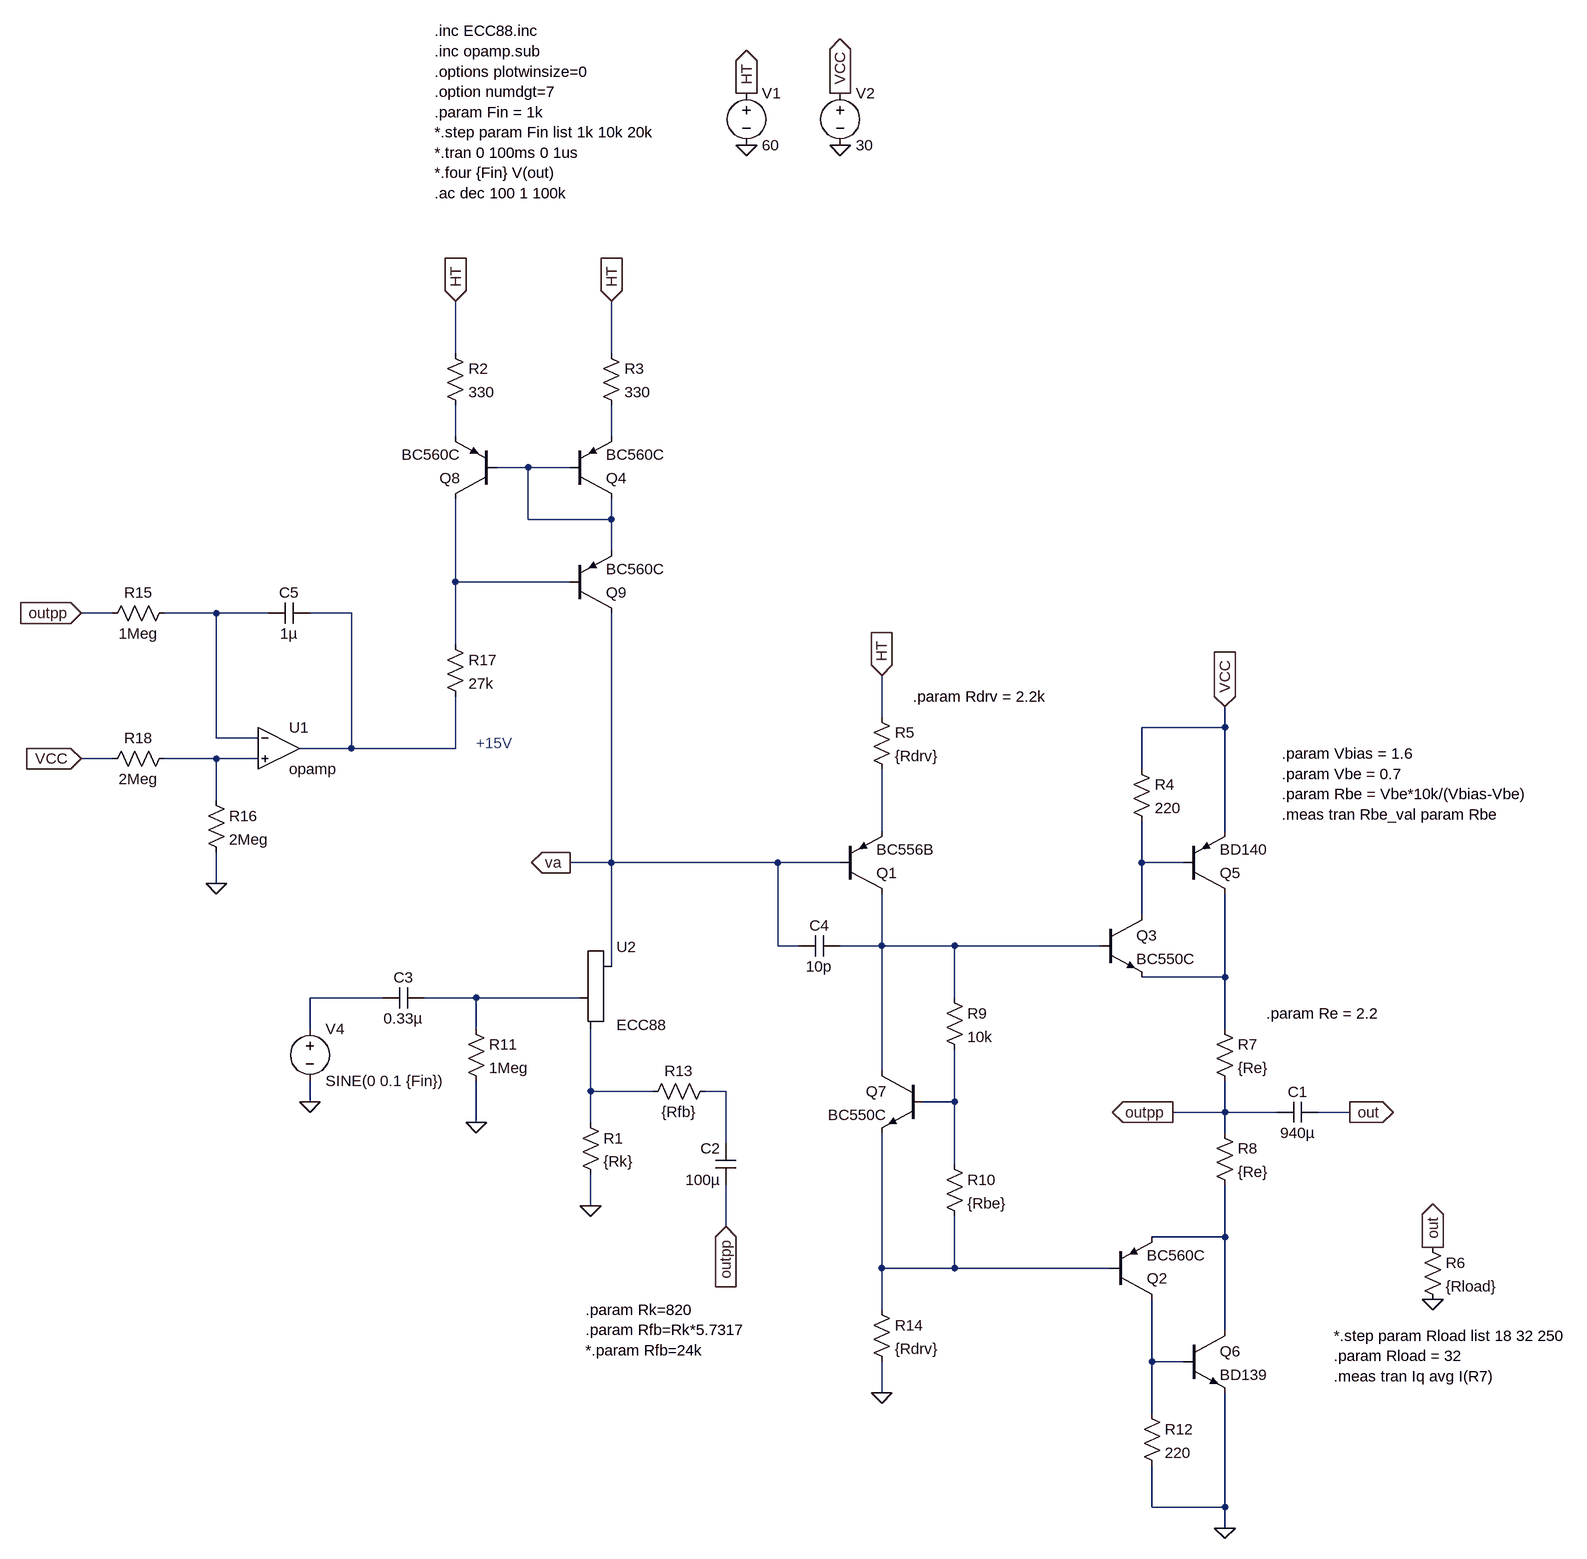
[diagram p0: schematic Hybrid 2.5.asc]
Hybrid 2.5.asc, the LTspice schematic file:
Version 4
SHEET 1 1536 2124
WIRE -1184 -160 -1184 -240
WIRE -944 -160 -944 -240
WIRE -1184 -32 -1184 -80
WIRE -944 -32 -944 -80
WIRE -1072 16 -1120 16
WIRE -1008 16 -1072 16
WIRE -1072 96 -1072 16
WIRE -944 96 -944 64
WIRE -944 96 -1072 96
WIRE -944 144 -944 96
WIRE -1184 192 -1184 64
WIRE -1008 192 -1184 192
WIRE -1712 240 -1760 240
WIRE -1552 240 -1632 240
WIRE -1472 240 -1552 240
WIRE -1344 240 -1408 240
WIRE -1184 288 -1184 192
WIRE -528 400 -528 336
WIRE 0 416 0 384
WIRE 0 416 -128 416
WIRE -1552 432 -1552 240
WIRE -1488 432 -1552 432
WIRE -1344 448 -1344 240
WIRE -1344 448 -1424 448
WIRE -1184 448 -1184 368
WIRE -1184 448 -1344 448
WIRE -1712 464 -1760 464
WIRE -1552 464 -1632 464
WIRE -1488 464 -1552 464
WIRE -128 480 -128 416
WIRE -1552 528 -1552 464
WIRE -528 576 -528 480
WIRE 0 576 0 416
WIRE -944 624 -944 240
WIRE -944 624 -1008 624
WIRE -688 624 -944 624
WIRE -592 624 -688 624
WIRE -128 624 -128 560
WIRE -64 624 -128 624
WIRE -1552 656 -1552 608
WIRE -128 704 -128 624
WIRE -688 752 -688 624
WIRE -656 752 -688 752
WIRE -528 752 -528 672
WIRE -528 752 -592 752
WIRE -416 752 -528 752
WIRE -192 752 -416 752
WIRE -944 784 -944 624
WIRE 0 800 0 672
WIRE 0 800 -128 800
WIRE -1296 832 -1408 832
WIRE -1152 832 -1232 832
WIRE -992 832 -1152 832
WIRE -416 832 -416 752
WIRE -1408 880 -1408 832
WIRE -1152 880 -1152 832
WIRE 0 880 0 800
WIRE -528 944 -528 752
WIRE -976 976 -976 880
WIRE -880 976 -976 976
WIRE -768 976 -800 976
WIRE -1408 992 -1408 960
WIRE -416 992 -416 912
WIRE -416 992 -464 992
WIRE 0 1008 0 960
WIRE 0 1008 -80 1008
WIRE 80 1008 0 1008
WIRE 192 1008 144 1008
WIRE -1152 1024 -1152 960
WIRE -976 1024 -976 976
WIRE 0 1040 0 1008
WIRE -768 1056 -768 976
WIRE -416 1088 -416 992
WIRE -976 1152 -976 1104
WIRE -768 1184 -768 1120
WIRE 0 1200 0 1120
WIRE 0 1200 -112 1200
WIRE -528 1248 -528 1040
WIRE -416 1248 -416 1168
WIRE -416 1248 -528 1248
WIRE -176 1248 -416 1248
WIRE -528 1312 -528 1248
WIRE 0 1344 0 1200
WIRE -112 1392 -112 1296
WIRE -64 1392 -112 1392
WIRE -528 1440 -528 1392
WIRE -112 1472 -112 1392
WIRE -112 1616 -112 1552
WIRE 0 1616 0 1440
WIRE 0 1616 -112 1616
WIRE 0 1648 0 1616
FLAG -736 -480 0
FLAG -736 -560 HT
IOPIN -736 -560 Out
FLAG -1408 992 0
FLAG -944 -240 HT
IOPIN -944 -240 In
FLAG -976 1152 0
FLAG -528 1440 0
FLAG -528 336 HT
IOPIN -528 336 In
FLAG -592 -480 0
FLAG -592 -560 VCC
IOPIN -592 -560 Out
FLAG 0 384 VCC
IOPIN 0 384 In
FLAG 192 1008 out
IOPIN 192 1008 Out
FLAG 320 1216 out
IOPIN 320 1216 Out
FLAG 320 1296 0
FLAG 0 1648 0
FLAG -80 1008 outpp
IOPIN -80 1008 Out
FLAG -768 1184 outpp
IOPIN -768 1184 In
FLAG -1008 624 va
IOPIN -1008 624 Out
FLAG -1760 240 outpp
IOPIN -1760 240 In
FLAG -1152 1024 0
FLAG -1184 -240 HT
IOPIN -1184 -240 In
FLAG -1552 656 0
FLAG -1760 464 VCC
IOPIN -1760 464 In
SYMBOL voltage -736 -576 R0
SYMATTR InstName V1
SYMATTR Value 60
SYMBOL Misc/triode -944 832 R0
SYMATTR InstName U2
SYMATTR Value ECC88
SYMBOL voltage -1408 864 R0
SYMATTR InstName V4
SYMATTR Value SINE(0 0.1 {Fin})
SYMATTR Value2 AC 1
SYMBOL pnp -1008 64 M180
SYMATTR InstName Q4
SYMATTR Value BC560C
SYMBOL res -960 -176 R0
SYMATTR InstName R3
SYMATTR Value 330
SYMBOL pnp -592 672 M180
SYMATTR InstName Q1
SYMATTR Value BC556B
SYMBOL res -544 384 R0
SYMATTR InstName R5
SYMATTR Value {Rdrv}
SYMBOL res -992 1008 R0
SYMATTR InstName R1
SYMATTR Value {Rk}
SYMBOL voltage -592 -576 R0
SYMATTR InstName V2
SYMATTR Value 30
SYMBOL res 304 1200 R0
SYMATTR InstName R6
SYMATTR Value {Rload}
SYMBOL res -16 864 R0
SYMATTR InstName R7
SYMATTR Value {Re}
SYMBOL res -16 1024 R0
SYMATTR InstName R8
SYMATTR Value {Re}
SYMBOL pnp -64 672 M180
SYMATTR InstName Q5
SYMATTR Value BD140
SYMBOL npn -64 1344 R0
SYMATTR InstName Q6
SYMATTR Value BD139
SYMBOL res -784 960 R90
WINDOW 0 0 56 VBottom 2
WINDOW 3 32 56 VTop 2
SYMATTR InstName R13
SYMATTR Value {Rfb}
SYMBOL cap 144 992 R90
WINDOW 0 0 32 VBottom 2
WINDOW 3 32 32 VTop 2
SYMATTR InstName C1
SYMATTR Value 940µ
SYMBOL cap -752 1120 R180
WINDOW 0 24 56 Left 2
WINDOW 3 24 8 Left 2
SYMATTR InstName C2
SYMATTR Value 100µ
SYMBOL pnp -176 1296 M180
SYMATTR InstName Q2
SYMATTR Value BC560C
SYMBOL npn -192 704 R0
SYMATTR InstName Q3
SYMATTR Value BC550C
SYMBOL res -144 464 R0
SYMATTR InstName R4
SYMATTR Value 220
SYMBOL res -128 1456 R0
SYMATTR InstName R12
SYMATTR Value 220
SYMBOL npn -464 944 M0
SYMATTR InstName Q7
SYMATTR Value BC550C
SYMBOL res -432 816 R0
SYMATTR InstName R9
SYMATTR Value 10k
SYMBOL res -432 1072 R0
SYMATTR InstName R10
SYMATTR Value {Rbe}
SYMBOL res -544 1296 R0
SYMATTR InstName R14
SYMATTR Value {Rdrv}
SYMBOL res -1168 864 R0
SYMATTR InstName R11
SYMATTR Value 1Meg
SYMBOL cap -1232 816 R90
WINDOW 0 0 32 VBottom 2
WINDOW 3 32 32 VTop 2
SYMATTR InstName C3
SYMATTR Value 0.33µ
SYMBOL cap -592 736 R90
WINDOW 0 0 32 VBottom 2
WINDOW 3 32 32 VTop 2
SYMATTR InstName C4
SYMATTR Value 10p
SYMBOL res -1616 224 R90
WINDOW 0 0 56 VBottom 2
WINDOW 3 32 56 VTop 2
SYMATTR InstName R15
SYMATTR Value 1Meg
SYMBOL res -1568 512 R0
SYMATTR InstName R16
SYMATTR Value 2Meg
SYMBOL cap -1408 224 R90
WINDOW 0 0 32 VBottom 2
WINDOW 3 32 32 VTop 2
SYMATTR InstName C5
SYMATTR Value 1µ
SYMBOL Opamps/opamp -1456 384 R0
SYMATTR InstName U1
SYMBOL pnp -1120 64 R180
SYMATTR InstName Q8
SYMATTR Value BC560C
SYMBOL res -1200 -176 R0
SYMATTR InstName R2
SYMATTR Value 330
SYMBOL res -1200 272 R0
SYMATTR InstName R17
SYMATTR Value 27k
SYMBOL pnp -1008 240 M180
SYMATTR InstName Q9
SYMATTR Value BC560C
SYMBOL res -1728 480 R270
WINDOW 0 32 56 VTop 2
WINDOW 3 0 56 VBottom 2
SYMATTR InstName R18
SYMATTR Value 2Meg
TEXT -1216 -656 Left 2 !.inc ECC88.inc\n.inc opamp.sub\n.options plotwinsize=0\n.option numdgt=7\n.param Fin = 1k\n*.step param Fin list 1k 10k 20k\n*.tran 0 100ms 0 1us\n*.four {Fin} V(out)\n.ac dec 100 1 100k
TEXT 168 1352 Left 2 !*.step param Rload list 18 32 250\n.param Rload = 32\n.meas tran Iq avg I(R7)
TEXT 88 456 Left 2 !.param Vbias = 1.6\n.param Vbe = 0.7\n.param Rbe = Vbe*10k/(Vbias-Vbe)\n.meas tran Rbe_val param Rbe
TEXT 64 856 Left 2 !.param Re = 2.2
TEXT -480 368 Left 2 !.param Rdrv = 2.2k
TEXT -984 1312 Left 2 !.param Rk=820\n.param Rfb=Rk*5.7317\n*.param Rfb=24k
TEXT -1152 440 Left 2 ;+15V

The netlist it stands for:
* Hybrid 2.5.asc
V1 HT 0 60
XU2 va N013 N014 ECC88
V4 N012 0 SINE(0 0.1 {Fin}) AC 1
Q4 N003 N003 N002 0 BC560C
R3 HT N002 330
Q1 N010 va N008 0 BC556B
R5 HT N008 {Rdrv}
R1 N014 0 {Rk}
V2 VCC 0 30
R6 out 0 {Rload}
R7 N011 outpp {Re}
R8 outpp N017 {Re}
Q5 N011 N009 VCC 0 BD140
Q6 N017 N019 0 0 BD139
R13 N015 N014 {Rfb}
C1 out outpp 940µ
C2 outpp N015 100µ
Q2 N019 N018 N017 0 BC560C
Q3 N009 N010 N011 0 BC550C
R4 VCC N009 220
R12 N019 0 220
Q7 N010 N016 N018 0 BC550C
R9 N010 N016 10k
R10 N016 N018 {Rbe}
R14 N018 0 {Rdrv}
R11 N013 0 1Meg
C3 N013 N012 0.33µ
C4 N010 va 10p
R15 N005 outpp 1Meg
R16 N007 0 2Meg
C5 N006 N005 1µ
XU1 N005 N007 N006 opamp Aol=100K GBW=10Meg  ; pins invin noninvin out
Q8 N004 N003 N001 0 BC560C
R2 HT N001 330
R17 N004 N006 27k
Q9 va N004 N003 0 BC560C
R18 VCC N007 2Meg
.model NPN NPN
.model PNP PNP
.lib standard.bjt
.inc ECC88.inc
.inc opamp.sub
.options plotwinsize=0
.option numdgt=7
.param Fin = 1k
*.step param Fin list 1k 10k 20k
*.tran 0 100ms 0 1us
*.four {Fin} V(out)
.ac dec 100 1 100k
*.step param Rload list 18 32 250
.param Rload = 32
.meas tran Iq avg I(R7)
.param Vbias = 1.6
.param Vbe = 0.7
.param Rbe = Vbe*10k/(Vbias-Vbe)
.meas tran Rbe_val param Rbe
.param Re = 2.2
.param Rdrv = 2.2k
.param Rk=820
.param Rfb=Rk*5.7317
*.param Rfb=24k
* +15V
.backanno
.end